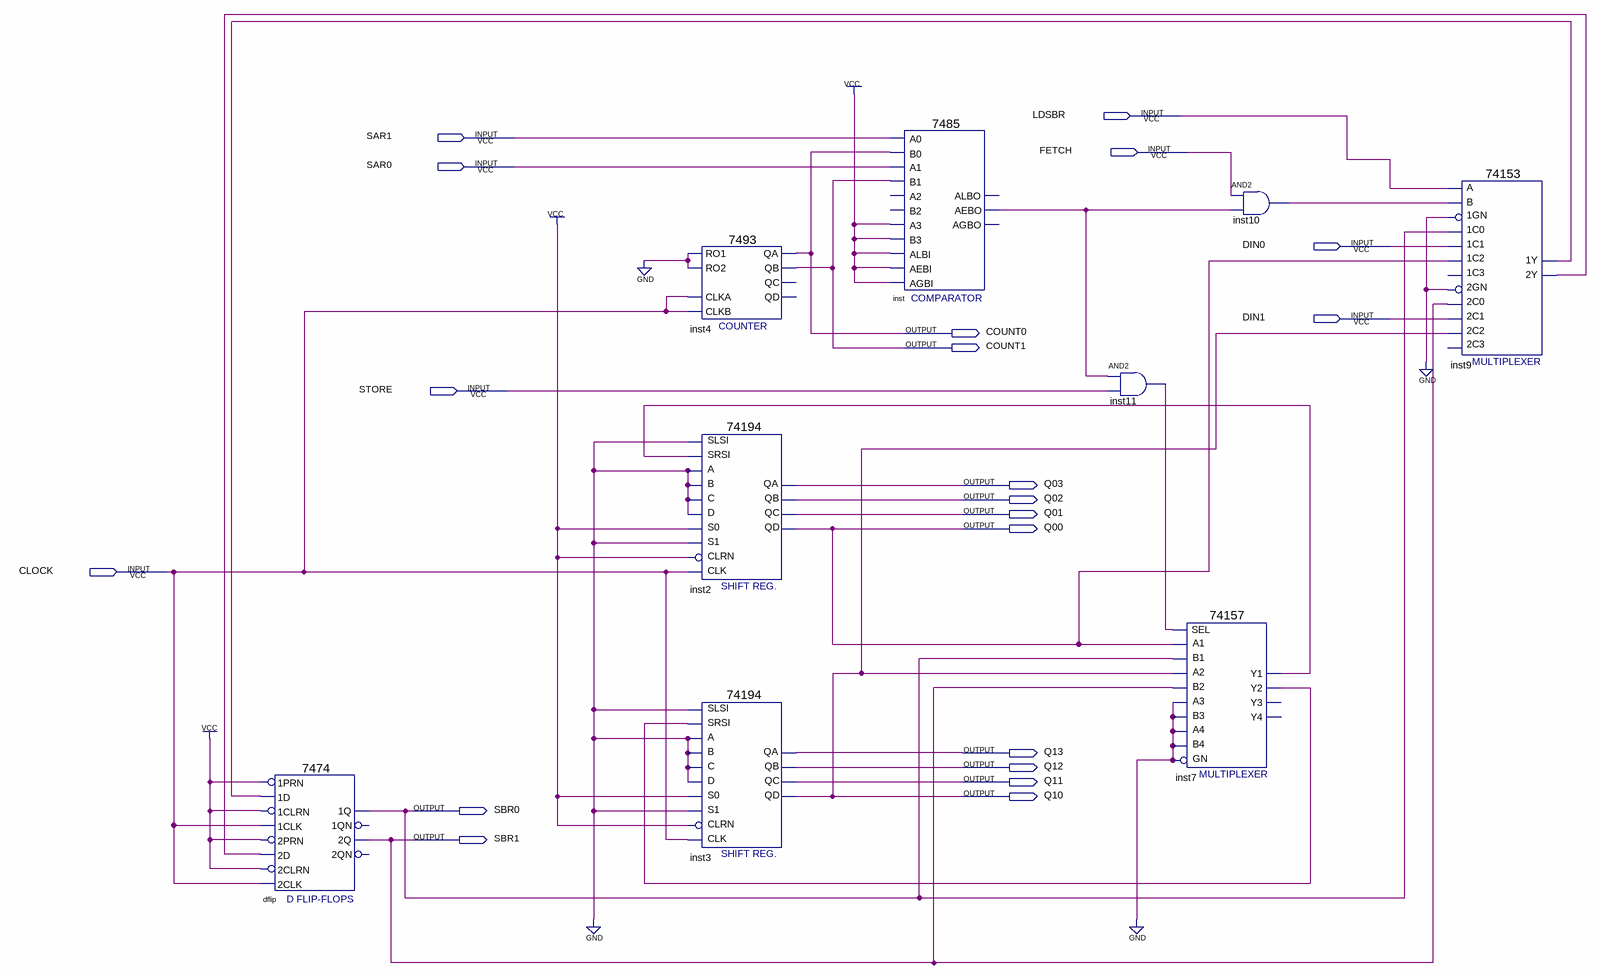
[diagram p0: schematic sheet]
// Quartus schematic lab2.bdf as structural Verilog: 9 symbols, 20 pins
module lab2 (
  input  LDSBR,
  input  SAR1,
  input  FETCH,
  input  SAR0,
  input  DIN0,
  input  DIN1,
  input  STORE,
  input  CLOCK,
  output COUNT0,
  output COUNT1,
  output Q03,
  output Q02,
  output Q01,
  output Q00,
  output Q13,
  output Q12,
  output Q11,
  output Q10,
  output SBR0,
  output SBR1
);

  wire inst7_y1, inst7_y2, inst9_1y, inst9_2y, inst10_out, inst11_out, inst_aebo;

  \7474  dflip (
    .\2D (inst9_2y), .\2PRN (1'b1), .\1CLK (CLOCK), .\1D (inst9_1y), .\1PRN (1'b1), .\2CLK (CLOCK),
    .\2CLRN (1'b1), .\1CLRN (1'b1), .\2Q (SBR1), .\1Q (SBR0));  // open: 1QN, 2QN
  \7493  inst4 (.RO1(1'b0), .RO2(1'b0), .CLKA(CLOCK), .CLKB(CLOCK), .QB(COUNT1), .QA(COUNT0));  // open: QC, QD
  \74194  inst2 (
    .SLSI(1'b0), .SRSI(inst7_y1), .B(1'b0), .C(1'b0), .CLK(CLOCK), .CLRN(1'b1), .D(1'b0), .S1(1'b0),
    .S0(1'b1), .A(1'b0), .QA(Q03), .QB(Q02), .QC(Q01), .QD(Q00));
  \74194  inst3 (
    .SLSI(1'b0), .SRSI(inst7_y2), .B(1'b0), .C(1'b0), .CLK(CLOCK), .CLRN(1'b1), .D(1'b0), .S1(1'b0),
    .S0(1'b1), .A(1'b0), .QA(Q13), .QB(Q12), .QC(Q11), .QD(Q10));
  \7485  inst (
    .A3(1'b1), .AEBI(1'b1), .AGBI(1'b1), .ALBI(1'b1), .A0(SAR1), .B0(COUNT0), .B3(1'b1), .A1(SAR0),
    .B1(COUNT1), .AEBO(inst_aebo));  // open: B2, A2, ALBO, AGBO
  and inst11 (inst11_out, inst_aebo, STORE);
  \74157  inst7 (
    .A1(Q00), .B1(SBR0), .SEL(inst11_out), .B2(SBR1), .A3(1'b0), .B3(1'b0), .A2(Q10), .B4(1'b0), .GN(1'b0),
    .A4(1'b0), .Y2(inst7_y2), .Y1(inst7_y1));  // open: Y4, Y3
  and inst10 (inst10_out, FETCH, inst_aebo);
  \74153  inst9 (
    .\1C1 (DIN0), .\1GN (1'b0), .\1C0 (SBR0), .\2C0 (SBR1), .\2GN (1'b0), .\2C2 (Q10), .\1C2 (Q00),
    .B(inst10_out), .A(LDSBR), .\2C1 (DIN1), .\1Y (inst9_1y), .\2Y (inst9_2y));  // open: 1C3, 2C3
endmodule
